# EAGLE design ESP32_ADC_HUB (EAGLE 9.5.1)
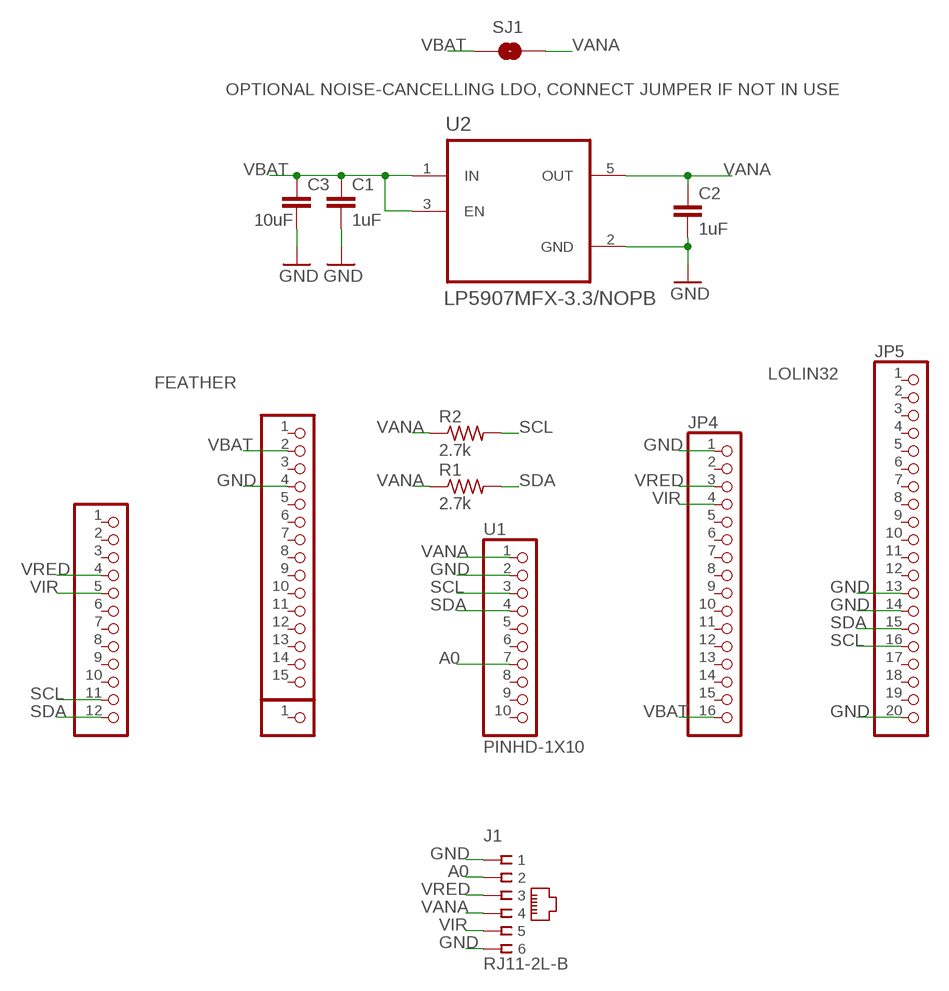
[diagram p0: schematic, sheet 1]

## Parts
C1  1uF  C-EU050-024X044  [C050-024X044]
C2  1uF  C-EU050-024X044  [C050-024X044]
C3  10uF  C-EU050-024X044  [C050-024X044]
J1  RJ11-2L-B  [RJ11-NO_SHIELD]
JP1  PINHD-1X12-CB  [1X12-CB]
JP2  PINHD-1X15-CB  [1X15-CB]
JP3  PINHD-1X1CB  [1X01-CLEANBIG]
JP4  PINHD-1X16  [1X16]
JP5  PINHD-1X20  [1X20]
R1  2.7k  R-US_0204/7  [0204/7]
R2  2.7k  R-US_0204/7  [0204/7]
SJ1  SOLDERJUMPERNC  [SJ_2S_SMALL]
U1  PINHD-1X10  [1X10-BIG]
U2  LP5907MFX-3.3/NOPB  [SOT95P280X145-5N]

## Nets
A0: J1.2 U1.7
GND: C1.2 C2.2 C3.2 J1.1 J1.6 JP2.4 JP4.1 JP5.13 JP5.14 JP5.20 U1.2 U2.2(GND)
SCL: JP1.11 JP5.16 R2.2 U1.3
SDA: JP1.12 JP5.15 R1.2 U1.4
VANA: C2.1 J1.4 R1.1 R2.1 SJ1.2 U1.1 U2.5(OUT)
VBAT: C1.1 C3.1 JP2.2 JP4.16 SJ1.1 U2.1(IN) U2.3(EN)
VIR: J1.5 JP1.5 JP4.4
VRED: J1.3 JP1.4 JP4.3
Unconnected: JP1.1 JP1.2 JP1.3 JP1.6 JP1.7 JP1.8 JP1.9 JP1.10 JP2.1 JP2.3 JP2.5 JP2.6 JP2.7 JP2.8 JP2.9 JP2.10 JP2.11 JP2.12 JP2.13 JP2.14 JP2.15 JP3.1 JP4.2 JP4.5 JP4.6 JP4.7 JP4.8 JP4.9 JP4.10 JP4.11 JP4.12 JP4.13 JP4.14 JP4.15 JP5.1 JP5.2 JP5.3 JP5.4 JP5.5 JP5.6 JP5.7 JP5.8 JP5.9 JP5.10 JP5.11 JP5.12 JP5.17 JP5.18 JP5.19 U1.5 U1.6 U1.8 U1.9 U1.10

## Notes on the sheet
- OPTIONAL NOISE-CANCELLING LDO, CONNECT JUMPER IF NOT IN USE
- LOLIN32
- FEATHER

## Library data of the parts
C1-C3 = rcl:C-EU: CAPACITOR, European symbol; SPICEPREFIX: C
J1 = con-tycoelectronics:RJ11: CORCOM Modular RJ Jacks No Shield Source: www.tycoelectronics.com .. ENG_DS_1654001_1099_RJ_L_0507.pdf; MF: TYCO ELECTRONICS; MPN: RJ11-2L-B; OC_FARNELL: unknown; OC_NEWARK: 83F4463
JP1 = adafruit:PINHD-1X12: PIN HEADER
JP2 = adafruit:PINHD-1X15: PIN HEADER
JP3 = adafruit:PINHD-1X1: Pin header 1x1 for 0.1" spacing With round pins
JP4 = pinhead:PINHD-1X16: PIN HEADER
JP5 = pinhead:PINHD-1X20: PIN HEADER
R1 R2 = adafruit:R-US_: RESISTOR, American symbol
SJ1 = headers:SOLDERJUMPER: Solder Jumper Standard SMD solder jumper. Used to automate production. Two varients : Normally Open and Normally Closed are the same, but have different paste layers. NC will have a large amount of paste and should jumper during reflow.
U1 = adafruit:PINHD-1X10: Pin header 1x10 0.1" spacing With round pins
U2 = LP5907MFX-3.3_NOPB:LP5907MFX-3.3/NOPB: IC REG LINEAR 3.3V 250MA SOT23; AVAILABILITY: Unavailable; DESCRIPTION: Linear Voltage Regulator IC 1 Output 250mA SOT-23-5; MF: Texas Instruments; MP: LP5907MFX-3.3/NOPB; PACKAGE: SOT-23 Texas Instruments; PRICE: None

## Board
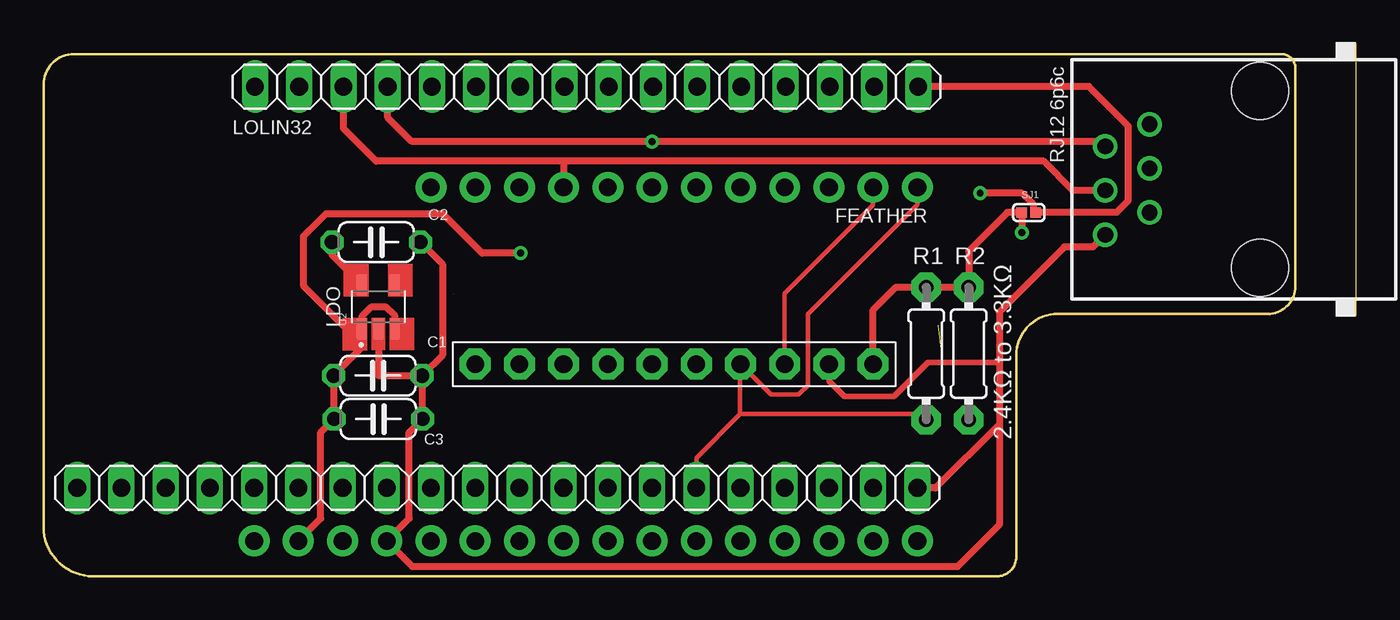
[diagram p1: board, top side]
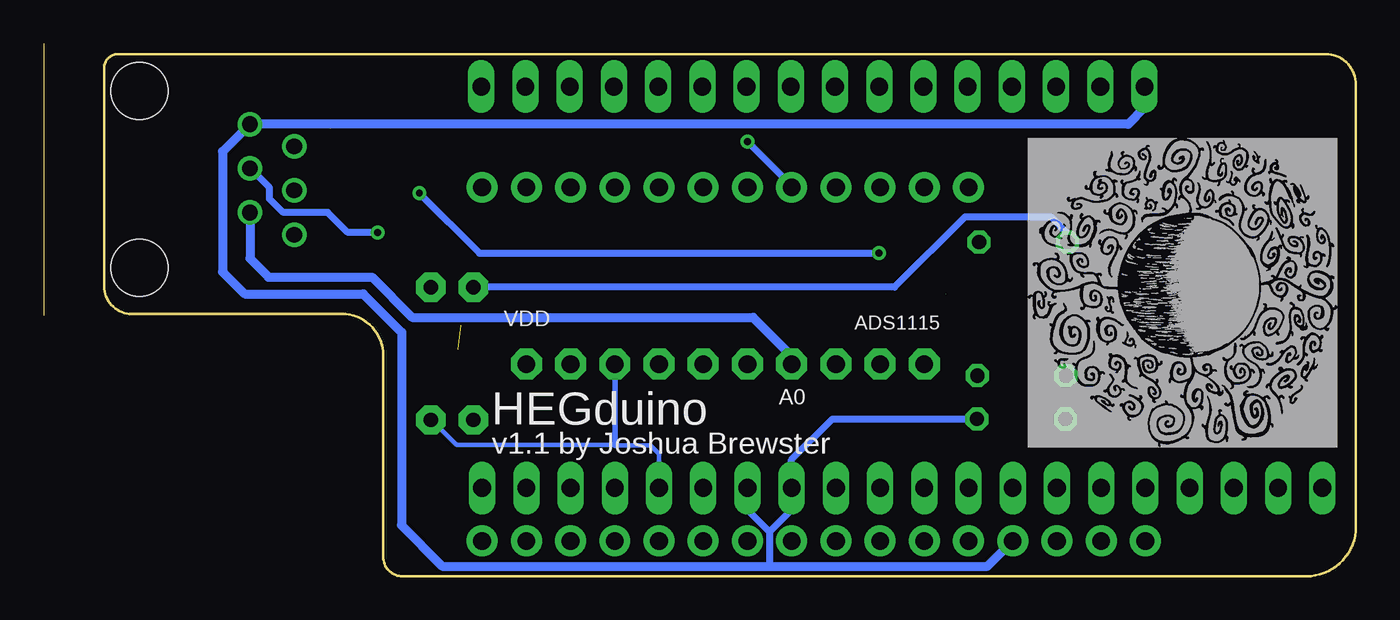
[diagram p2: board, bottom side, seen from below]

Size 71.91 x 30 mm. Coordinates in mm from the lower left corner, seen from the top.
Outline: 2.86,0 arc-90 0,2.86 0,28.26 arc-90 1.75,30 71.12,30 arc-90 71.91,29.21 71.91,16.67 arc-90 70.33,15.08 58.26,15.08 arc90 55.88,12.7 55.88,1.11 arc-90 54.77,0 2.86,0
Copper layers (1*16): Top 0.035mm / dielectric 1.5mm / Bottom 0.035mm
Design rules "adafruit 7-7 *": minimum track width 6mil, minimum drill 15.5mil, track to track 8mil, track to pad 7mil, pad to pad 7mil, via to via 7mil, smd to smd 7mil, copper to edge 10mil, drill to drill 8mil, minimum pad ring 10mil, minimum via ring 8mil, stop-mask expansion 2mil, vias tented up to drill 20mil, thermal gap 10mil

### Footprints (pad centres in the part's own frame; a part is rotated, then mirrored left to right if it is on the bottom)
C050-024X044 = drill 0.813 octagon: 1 -2.54,0; 2 2.54,0
RJ11-NO_SHIELD = drill 0.9 pad 1.4: 1 -3.175,8.89; 2 -1.905,6.35; 3 -0.635,8.89; 4 0.635,6.35; 5 1.905,8.89; 6 3.175,6.35 | hole 3.251: -5.08,0; 5.08,0
1X12-CB = drill 1.016 pad 1.778: 1 -13.97,0; 2 -11.43,0; 3 -8.89,0; 4 -6.35,0; 5 -3.81,0; 6 -1.27,0; 7 1.27,0; 8 3.81,0; 9 6.35,0; 10 8.89,0; 11 11.43,0; 12 13.97,0
1X15-CB = drill 1.016 pad 1.778: 1 -17.78,0; 2 -15.24,0; 3 -12.7,0; 4 -10.16,0; 5 -7.62,0; 6 -5.08,0; 7 -2.54,0; 8 0,0; 9 2.54,0; 10 5.08,0; 11 7.62,0; 12 10.16,0; 13 12.7,0; 14 15.24,0; 15 17.78,0
1X01-CLEANBIG = drill 1.016 pad 1.778: 1 0,0
1X16 = drill 1.016 long: 1 -19.05,0; 2 -16.51,0; 3 -13.97,0; 4 -11.43,0; 5 -8.89,0; 6 -6.35,0; 7 -3.81,0; 8 -1.27,0; 9 1.27,0; 10 3.81,0; 11 6.35,0; 12 8.89,0; 13 11.43,0; 14 13.97,0; 15 16.51,0; 16 19.05,0
1X20 = drill 1.016 long: 1 -24.13,0; 2 -21.59,0; 3 -19.05,0; 4 -16.51,0; 5 -13.97,0; 6 -11.43,0; 7 -8.89,0; 8 -6.35,0; 9 -3.81,0; 10 -1.27,0; 11 1.27,0; 12 3.81,0; 13 6.35,0; 14 8.89,0; 15 11.43,0; 16 13.97,0; 17 16.51,0; 18 19.05,0; 19 21.59,0; 20 24.13,0
0204/7 = drill 0.813 pad 1.676 octagon: 1 -3.81,0; 2 3.81,0
SJ_2S_SMALL = smd 0.6 x 0.6: 1 -0.4,0; 2 0.4,0
1X10-BIG = drill 1.016 pad 1.778 octagon: 1 -11.43,0; 2 -8.89,0; 3 -6.35,0; 4 -3.81,0; 5 -1.27,0; 6 1.27,0; 7 3.81,0; 8 6.35,0; 9 8.89,0; 10 11.43,0
SOT95P280X145-5N = smd 1.21 x 0.59: 1 -1.255,0.95; 2 -1.255,0; 3 -1.255,-0.95; 4 1.255,-0.95; 5 1.255,0.95

### Placement (x,y rotation side)
C1  19.21,11.53 0 top
C2  19.11,19.2 0 top
C3  19.23,9.04 0 top
J1  69.88,22.81 90 top
JP1  36.23,22.35 0 top
JP2  29.88,2.03 0 top
JP3  50.2,2.03 0 top
JP4  31.2,28.14 0 top
JP5  26.07,5.08 0 top
R1  50.7,12.8 270 top
R2  53.14,12.8 270 top
SJ1  56.6,20.9 180 top
U1  36.23,12.19 180 top
U2  19.23,15.49 90 top

### Tracks (layer width: path | path; a pad name or v marks a point on that pad's centre or on a via)
A0
  Bottom 0.508: U1.7 32.42,12.67 34.63,14.88 54.21,14.88 56.52,17.2 62.47,17.2 63.53,18.26 J1.2
GND
  Top 0.305: U1.2 45.12,11.23 46.01,10.34 48.85,10.34 50.81,12.29 54.9,12.29 | 54.87,10.69 54.9,10.72
  Top 0.406: J1.1 60.28,18.92 58.63,18.92 54.9,15.19 54.9,12.29 54.9,10.72 54.9,8.74 | 54.9,8.74 51.24,5.08 JP5.20 | 54.9,8.74 54.9,2.95 52.51,0.56 21.19,0.56 JP2.4 21.01,3.33 21.01,8.28 C3.2 21.75,9.07 C1.2 | C2.2 22.92,17.93 22.92,12.7 C1.2 | U2.2 19.25,14.22 19.25,11.53 C1.2
  Bottom 0.406: 33.69,0.61 33.71,0.58 | 33.69,2.56 32.42,3.83 JP5.13 32.42,6.71 30.08,9.04 C3.2 | 33.69,2.56 33.69,0.61 | JP5.14 34.96,3.83 33.69,2.56 | 33.69,0.61 33.69,0.58
  Bottom 0.508: JP4.1 12.15,26.92 13.09,25.98 J1.6 65.11,24.41 65.11,17.5 63.84,16.23 57.03,16.23 54.82,14.02 54.82,2.97 54.84,2.95 52.48,0.58 33.71,0.58 33.69,0.58 21.16,0.58 JP2.4
S$6  (1 unrouted)
S$8  (1 unrouted)
SCL
  Top 0.254: JP1.11 47.66,21.34 42.58,16.26 U1.3
  Bottom 0.254: 42.58,7.54 51.68,7.54 52.59,8.46 | 42.58,7.52 40.52,7.52 40.04,7.04 JP5.16 | 52.6,8.46 52.59,8.46 | R2.2 53.12,8.99 52.59,8.46
  Bottom 0.305: 42.58,7.52 42.58,7.54 U1.3
SDA
  Top 0.254: 40.01,9.32 40.01,12.17 U1.4 41.79,10.44 43.36,10.44 43.9,10.97 43.9,15.06 50.2,21.36 JP1.12 | R1.2 50.35,9.34 40.06,9.34 40.06,9.37 40.01,9.32 | 40.01,9.32 37.5,6.81 JP5.15
VANA  (via drill 0.39)
  Top 0.406: U1.1 47.66,15.29 48.98,16.61 R1.1 R2.1 53.14,18.69 55.36,20.9 SJ1.2 v56.2,19.77 v56.19,19.76 | C2.1 16.57,18.47 U2.5
  Bottom 0.406: v56.19,19.76 57.92,19.76 59.06,20.9 61.63,20.9 62.41,21.69 62.41,22.33 J1.4 | R1.1 26.5,16.61 22.46,20.65 17.51,20.65 16.57,19.71 C2.1
VB  (1 unrouted)
VBAT  (via drill 0.39)
  Top 0.406: JP4.16 60.05,28.14 62.31,25.88 62.31,21.58 61.64,20.9 SJ1.1 56.88,21.02 56.88,21.36 56.22,22.02 v53.8,22.02 | JP2.2 15.93,3.33 15.93,8.28 C3.1 16.67,9.07 C1.1 18.28,13.15 U2.1 | U2.3 20.18,14.98 19.69,15.47 18.83,15.47 18.28,14.92 U2.1 | v27.41,18.57 25.2,18.57 22.94,20.83 16.21,20.83 14.92,19.53 14.92,16.71 17.39,14.24 U2.1
  Bottom 0.406: v53.8,22.02 50.35,18.57 v27.41,18.57
VIR  (via drill 0.39)
  Top 0.254: JP4.4 19.79,28.12
  Top 0.406: J1.5 60.97,24.71 60.69,24.99 34.99,24.99 34.98,24.99 v34.96,24.99 21.15,24.99 19.77,26.37 JP4.4
  Bottom 0.406: v34.96,24.99 32.42,22.45 JP1.5
VRED
  Top 0.254: JP4.3 17.25,28.12
  Top 0.406: 29.88,23.85 19.11,23.85 17.23,25.73 JP4.3 | 29.88,23.85 JP1.4 | J1.3 59.14,22.17 57.46,23.85 29.88,23.85
(copper drawn outside any net)
  shapes: Top area x5

### Text on the board
tPlace: 2.4KΩ to 3.3KΩ
bPlace: HEGduino | C:/Users/crazy/Desktop/soliciting/MaxEntFiltered.bmp | v1.1 by Joshua Brewster
tNames: LOLIN32 | RJ12 6p6c | FEATHER | LDO
bNames: ADS1115 | VDD | A0